# Altium schematic sheet usb.SchDoc: MCB | USB
size A4; DocumentNumber: 6; SheetNumber: 6; SheetTotal: 12
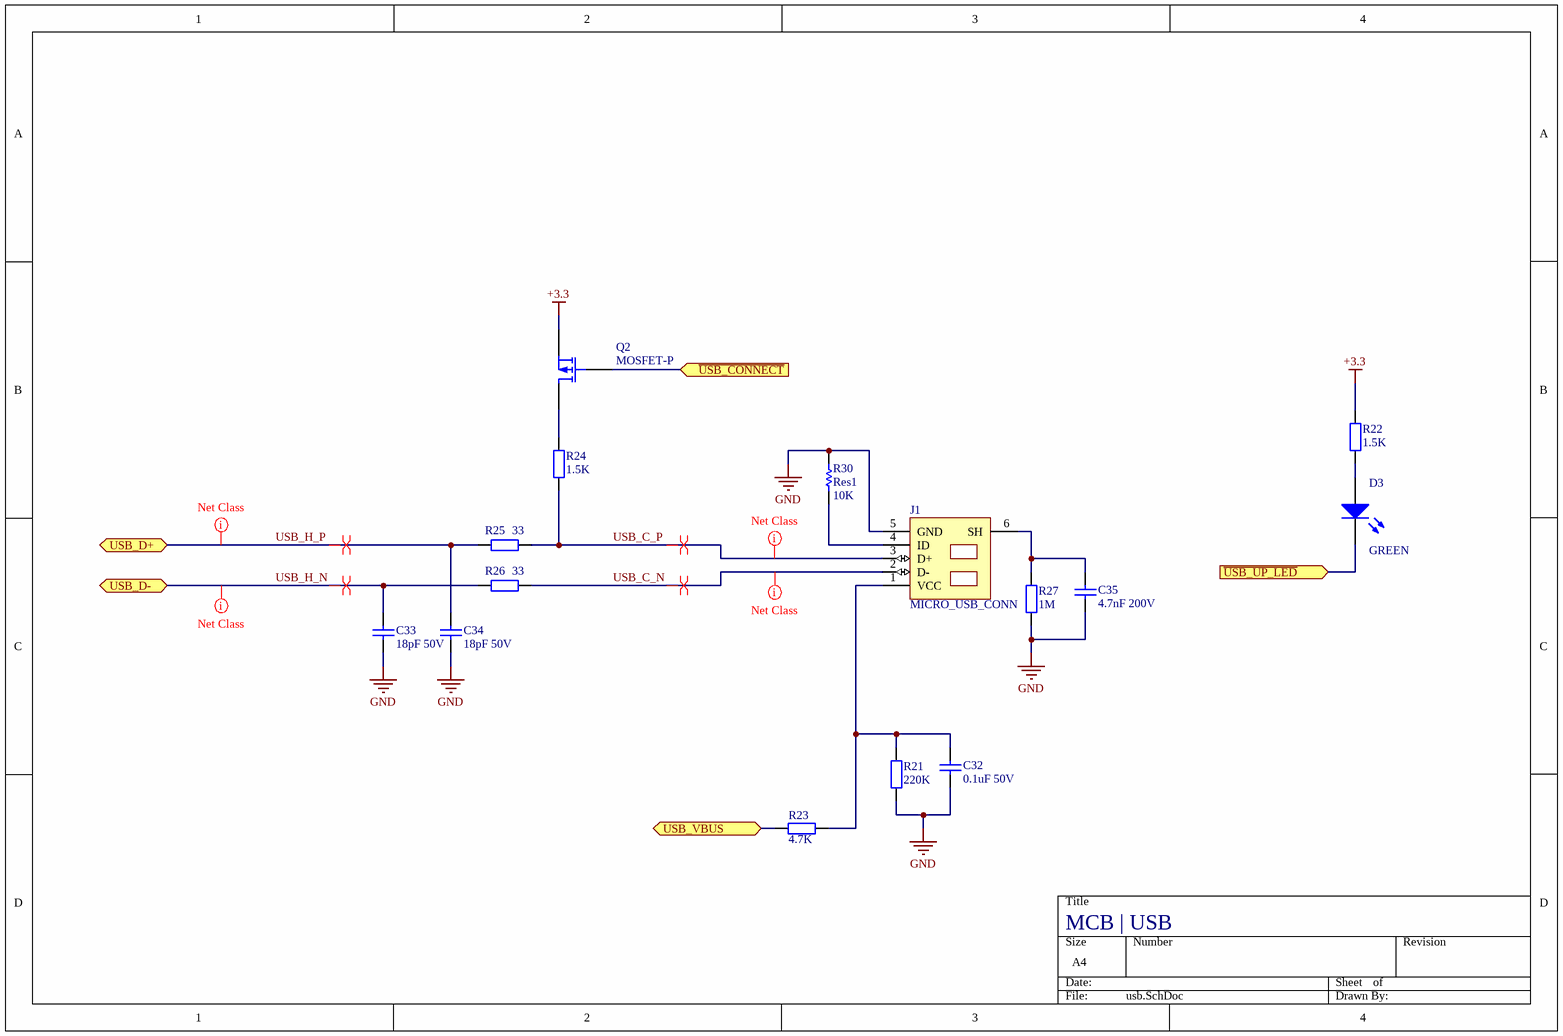
[diagram p0: usb.SchDoc]

## Parts
C32  value 0.1uF 50V  [C0805]  (hidden comment: Cap)
C33  value 18pF 50V  [C0805]  (hidden comment: Cap)
C34  value 18pF 50V  [C0805]  (hidden comment: Cap)
C35  value 4.7nF 200V  [C0805]  (hidden comment: Cap)
D3  value GREEN  [LGQ971]
J1  MICRO_USB_CONN  [USB_MICRO_CONNECTOR]
Q2  MOSFET-P  [bsh201]
R21  value 220K  [R0603]  (hidden comment: Res)
R22  value 1.5K  [R0603]  (hidden comment: Res)
R23  value 4.7K  [R0603]  (hidden comment: Res)
R24  value 1.5K  [R0603]  (hidden comment: Res)
R25  value 33  [R0603]  (hidden comment: Res)
R26  value 33  [R0603]  (hidden comment: Res)
R27  value 1M  [R0603]  (hidden comment: Res)
R30  Res1  value 10K  [R0603]

## Ports
USB_D+ (bidir), USB_D- (bidir), USB_VBUS, ~{USB_CONNECT} (in), ~{USB_UP_LED} (in)

## Nets
+3.3: Q2.3(S) R22.2
GND: C32.2 C33.2 C34.2 C35.2 J1.5(GND) R21.1 R27.1 R30.2
~{USB_CONNECT}: Q2.2(G) ; port ~{USB_CONNECT}
~{USB_UP_LED}: D3.2(K) ; port ~{USB_UP_LED}
USB_C_N: J1.2(D-) R26.2
USB_C_P: J1.3(D+) R24.1 R25.2
USB_H_N: C33.1 R26.1 ; port USB_D-
USB_H_P: C34.1 R25.1 ; port USB_D+
USB_VBUS: R23.1 ; port USB_VBUS
NetC32_1: C32.1 J1.1(VCC) R21.2 R23.2
NetC35_1: C35.1 J1.6(SH) R27.2
NetD3_1: D3.1(A) R22.1
NetJ1_4: J1.4(ID) R30.1
NetQ2_1: Q2.1(D) R24.2

## Layout directives
differential pair: USB_C_N, USB_C_P, USB_H_N, USB_H_P
net class Usb: USB_C_N, USB_C_P, USB_H_N, USB_H_P

## Library data of the parts
C32-C35 = Cap: Capacitor
  C32: farnell: 1414664
  C33 C34: farnell: 1414673
  C35: farnell: 1414695
D3 = LED2: Typical RED, GREEN, YELLOW, AMBER GaAs LED; farnell: 1226371
J1 = MICRO_USB_CONN: MOLEX - 47346-0001 - RECEPTACLE, MICRO USB B, BOTTOM MOUNT; farnell: 1568026
Q2 = MOSFET-P: P-Channel MOSFET; farnell: 1758073
R21-R27 = Res2: Resistor
  R21: farnell: 9330836
  R22 R24: farnell: 9330607
  R23: farnell: 9331247
  R25 R26: farnell: 9331050
  R27: farnell: 9330410
R30 = Res1: Resistor; Published: 8-Jun-2000; LatestRevisionDate: 17-Jul-2002; LatestRevisionNote: Re-released for DXP Platform.; PackageReference: AXIAL-0.3; Publisher: Altium Limited; farnell: 1576297